# Altium schematic sheet LED-drive-Green.SchDoc
size A4; SheetNumber: 3; SheetTotal: 3
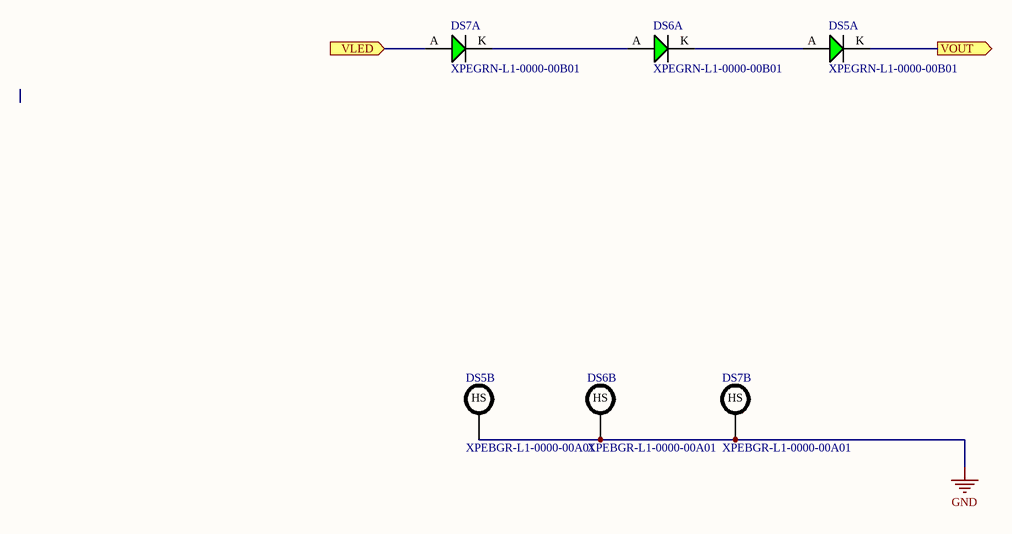
[diagram p0: LED-drive-Green.SchDoc]

## Parts
DS5  XPEGRN-L1-0000-00B01  [Cree XLamp XP-E2 (red and green LED)]  (parts A,B of 2)
DS6  XPEGRN-L1-0000-00B01  [Cree XLamp XP-E2 (red and green LED)]  (parts A,B of 2)
DS7  XPEGRN-L1-0000-00B01  [Cree XLamp XP-E2 (red and green LED)]  (parts A,B of 2)

## Ports
VLED (in), VOUT (out)

## Nets
GND: DS5.HS DS6.HS DS7.HS
VLED: DS7.A ; port VLED
VOUT: DS5.K ; port VOUT
NetDS5_A: DS5.A DS6.K
NetDS6_A: DS6.A DS7.K

## Library data of the parts
DS5-DS7 = XPEBGR-L1-0000-00A01: LED, Cree XLamp XP-E2 Series, Green, 535 nm, 135 °, 87.4 lm, 1 A; ComponentLink1Description: Element14; ComponentLink1URL: https://au.element14.com/cree/xpebrd-l1-0000-00601/led-smd-xlamp-xpe-e-red-62lm/dp/2335107